# Altium schematic sheet mainsheet.SchDoc
size A4
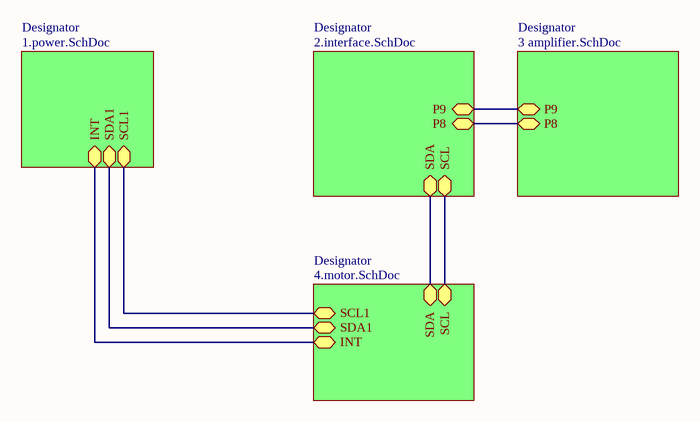
[diagram p0: mainsheet.SchDoc]

## Sub-sheets
Designator = 1.power.SchDoc: SDA1 (bidir), SCL1 (bidir), INT (bidir)
Designator = 2.interface.SchDoc: P9 (bidir), P8 (bidir), SCL (bidir), SDA (bidir)
Designator = 3 amplifier.SchDoc: P9 (bidir), P8 (bidir)
Designator = 4.motor.SchDoc: SDA (bidir), SCL (bidir), SCL1 (bidir), SDA1 (bidir), INT (bidir)

## Nets
(unnamed): sheet Designator/SDA1, sheet Designator/SDA1
(unnamed): sheet Designator/SCL1, sheet Designator/SCL1
(unnamed): sheet Designator/INT, sheet Designator/INT
(unnamed): sheet Designator/P9, sheet Designator/P9
(unnamed): sheet Designator/P8, sheet Designator/P8
(unnamed): sheet Designator/SCL, sheet Designator/SCL
(unnamed): sheet Designator/SDA, sheet Designator/SDA